# Altium schematic sheet LoRa_Module.SchDoc
size A4; SheetNumber: 7; SheetTotal: 13
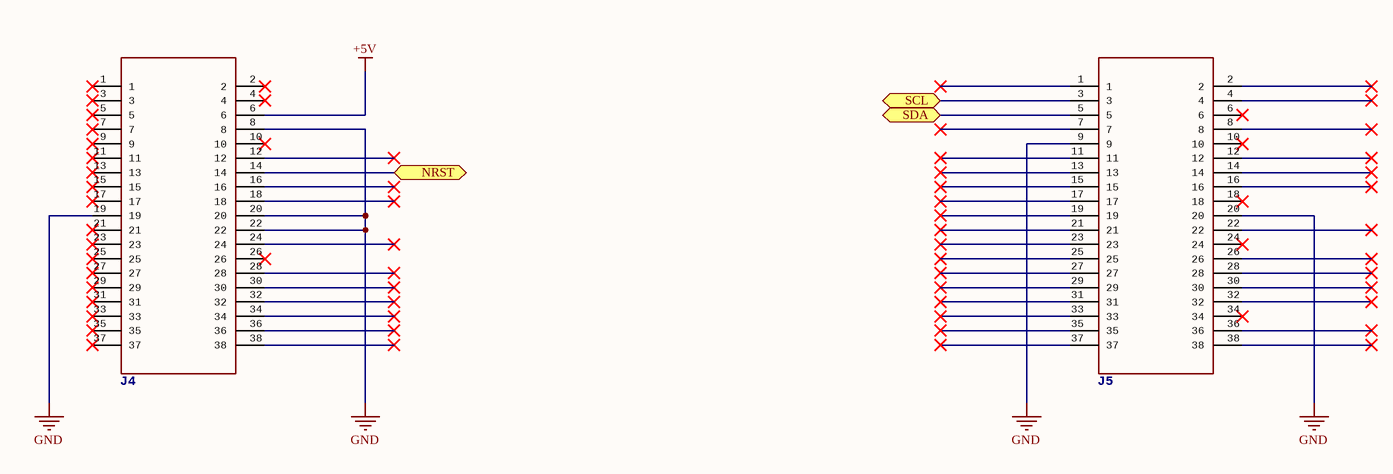
[diagram p0: LoRa_Module.SchDoc]

## Parts
J4  SSW-119-01-F-D  [SSW-119-01-F-D]  (value not drawn)
J5  SSW-119-01-F-D  [SSW-119-01-F-D]  (value not drawn)

## Ports
NRST (bidir), SCL (bidir), SDA (bidir)

## Nets
+5V: J4.6
GND: J4.8 J4.19 J4.20 J4.22 J5.9 J5.20
NRST: J4.14 ; port NRST
SCL: J5.3 ; port SCL
SDA: J5.5 ; port SDA

Not connected (* = marked no-connect by the designer): J4 1* 2* 3* 4* 5* 7* 9* 10* 11* 12* 13* 15* 16* 17* 18* 21* 23* 24* 25* 26* 27* 28* 29* 30* 31* 32* 33* 34* 35* 36* 37* 38*; J5 1* 2* 4* 6* 7* 8* 10* 11* 12* 13* 14* 15* 16* 17* 18* 19* 21* 22* 23* 24* 25* 26* 27* 28* 29* 30* 31* 32* 33* 34* 35* 36* 37* 38*

## Library data of the parts
J4 J5 = 1095-0013: CONN RCPT 38POS 0.1 GOLD PCB; manufacturer: Samtec Inc.; id: 461832; inventory_price: 6.48; x_Capacitance: Not Applicable; x_current: 5.7A per Contact; x_max_temp: 125°C; x_min_temp: -55°C; x_port_to_unleashed: No; partnumber: 1095-0013; Manufacturer Part Number: SSW-119-01-F-D; created_on: 29/03/2022 9:34:22 PM; parttype: Rectangular Connectors - Headers, Receptacles, Female Sockets; rohs: 1; updated_on: 29/03/2022 9:39:06 PM; x_inductance: Not Applicable; x_Power: Not Applicable; x_resistance: Not Applicable; x_temp_coef: Not Applicable; x_Tolerance: Not Applicable; x_Vol: Not Applicable